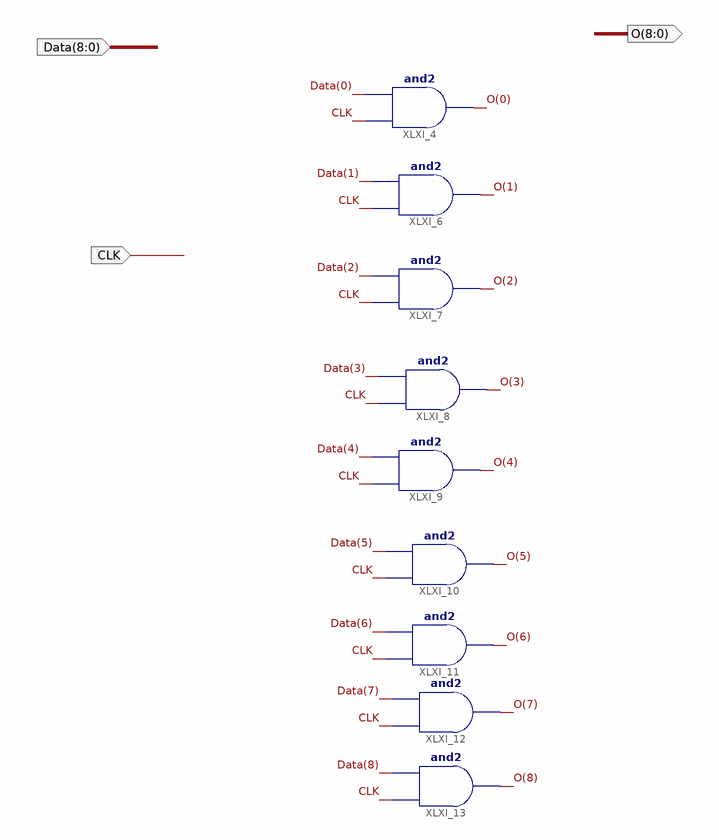
[diagram p0: schematic sheet 1]
// Xilinx ISE schematic BlinkLED.sch (spartan6) as structural Verilog: 9 symbols, 3 ports
module BlinkLED (
  input  [8:0] Data,
  input  CLK,
  output [8:0] O
);

  and XLXI_4 (O[0], CLK, Data[0]);
  and XLXI_6 (O[1], CLK, Data[1]);
  and XLXI_7 (O[2], CLK, Data[2]);
  and XLXI_8 (O[3], CLK, Data[3]);
  and XLXI_9 (O[4], CLK, Data[4]);
  and XLXI_10 (O[5], CLK, Data[5]);
  and XLXI_11 (O[6], CLK, Data[6]);
  and XLXI_12 (O[7], CLK, Data[7]);
  and XLXI_13 (O[8], CLK, Data[8]);
endmodule
